# EAGLE design lp_extended (EAGLE 6.5.0)
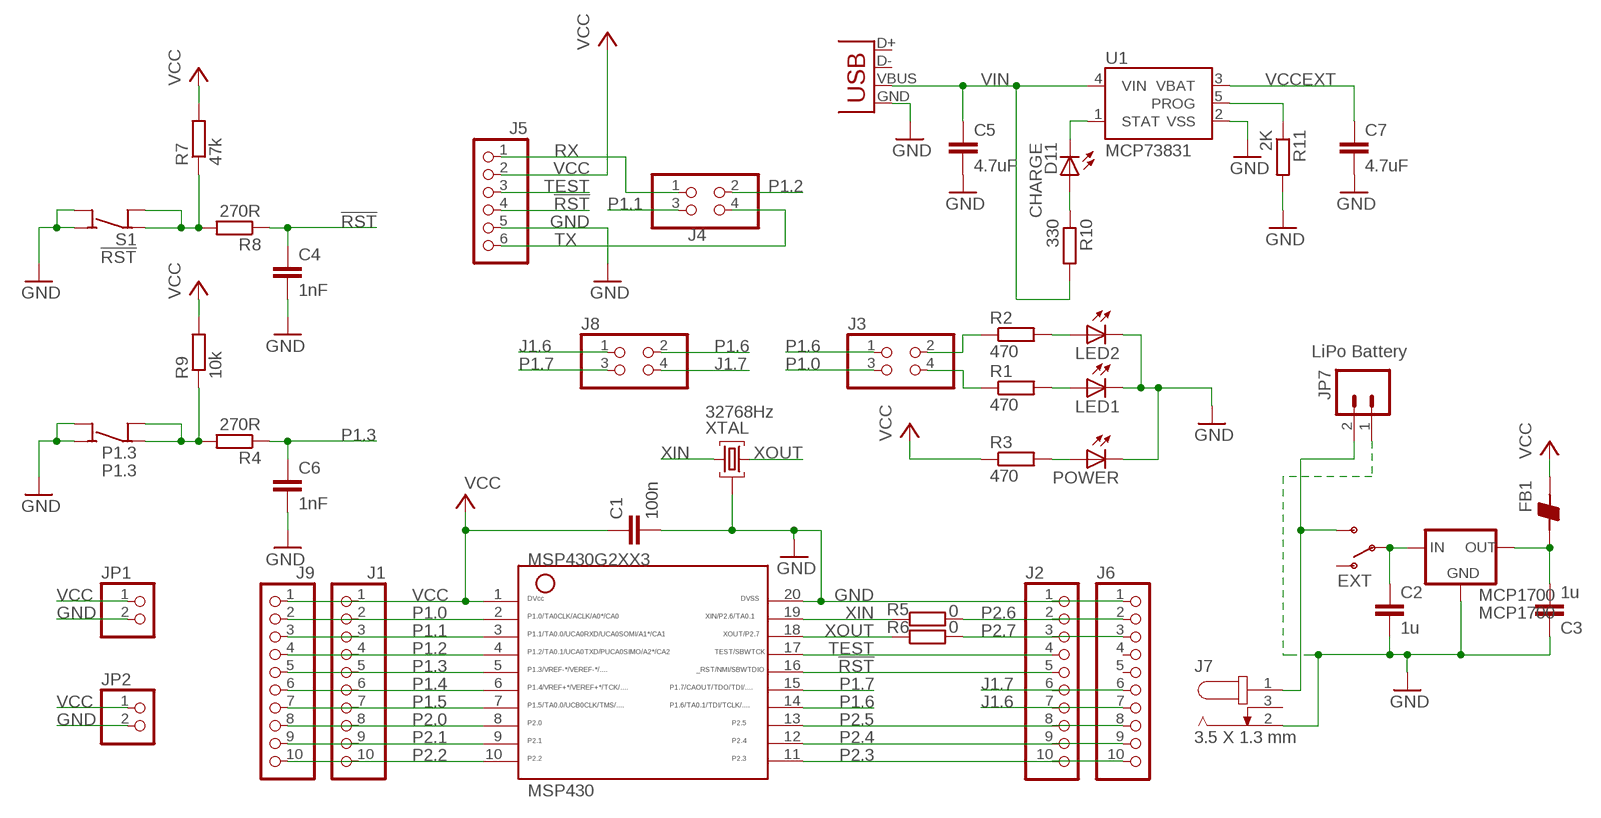
[diagram p0: schematic, sheet 1]

## Parts
C1  100n  C-EUC0805  [C0805]
C2  1u  C-EUC0805  [C0805]
C3  1u  C-EUC0805  [C0805]
C4  1nF  C-EUC0805  [C0805]
C5  4.7uF  C-EUC0805  [C0805]
C6  1nF  C-EUC0805  [C0805]
C7  4.7uF  C-EUC0805  [C0805]
D11  CHARGE  LEDCHIPLED_1206  [CHIPLED_1206]
FB1  BEAD-0805  [0805]
J1  PH1X10OCT076  [PH1X10OCT76]
J2  PH1X10OCT076  [PH1X10OCT76]
J3  PINHD-2X2  [2X02]
J4  PINHD-2X2  [2X02]
J5  PINHD-1X6  [1X06]
J6  PH1X10OCT076  [PH1X10OCT76]
J7  3.5 X 1.3 mm  DC_JACK_3.5X1.3MM  [3.5X1.3MM_DC_JACK]
J8  PINHD-2X2  [2X02]
J9  PH1X10OCT076  [PH1X10OCT76]
JP1  PINHD-1X2  [1X02]
JP2  PINHD-1X2  [1X02]
JP7  LiPo Battery  M02JST-PTH-2  [JST-2-PTH]
LED1  LEDCHIPLED_1206  [CHIPLED_1206]
LED2  LEDCHIPLED_1206  [CHIPLED_1206]
MCP1700  MCP1700  MCP1700SOT-23  [SOT-23]
MSP430  MSP430N  G2XX3---N20HEX  [DIP20_HEX]
ON  EXT  SWITCH-SPSTPTH  [SWITCH-SPDT]
P1.3  P1.3  SPST4  [6MMTACTILE_4PIN]
POWER  LEDCHIPLED_1206  [CHIPLED_1206]
R1  470  R-EU_R0805  [R0805]
R2  470  R-EU_R0805  [R0805]
R3  470  R-EU_R0805  [R0805]
R4  270R  R-EU_R0805  [R0805]
R5  0  R-EU_R0805  [R0805]
R6  0  R-EU_R0805  [R0805]
R7  47k  R-EU_R0805  [R0805]
R8  270R  R-EU_R0805  [R0805]
R9  10k  R-EU_R0805  [R0805]
R10  330  R-EU_R0805  [R0805]
R11  2K  R-EU_R0805  [R0805]
S1  !RST  SPST4  [6MMTACTILE_4PIN]
U1  MCP73831  [SOT23-5]
X1  Mini USB  USBOLD  [USB-MINIB-OLD]
XTAL  32768Hz  QUARZ5  [QUARZ5]

## Nets
!RST: C4.1 J2.5 J5.4 MSP430.16 R8.1
GND [GND]: C1.2 C2.2 C3.1 C4.2 C5.2 C6.2 C7.2 J2.1 J5.5 J6.1 J7.2 JP1.2 JP2.2 JP7.1 LED1.C LED2.C MCP1700.1(GND) MSP430.20 P1.3.A1(NO) P1.3.A2(NO) POWER.C R11.2 S1.A1(NO) S1.A2(NO) U1.2(VSS) X1.GND XTAL.GND@0
J1.6: J2.7 J6.7 J8.1
J1.7: J2.6 J6.6 J8.4
N$1: J3.2 R2.1
N$2: J3.4 R1.1
N$3 [VCC]: C2.1 MCP1700.3(IN) ON.2(P)
N$4: P1.3.B1(COM) P1.3.B2(COM) R4.2 R9.1
N$5: R7.1 R8.2 S1.B1(COM) S1.B2(COM)
N$6 [VCC]: C3.2 FB1.1 MCP1700.2(OUT)
N$7: D11.A R10.1
N$11: POWER.A R3.2
N$13: LED1.A R1.2
N$14: LED2.A R2.2
P1.0: J1.2 J3.3 J9.2 MSP430.2
P1.1: J1.3 J4.3 J9.3 MSP430.3
P1.2: J1.4 J4.2 J9.4 MSP430.4
P1.3: C6.1 J1.5 J9.5 MSP430.5 R4.1
P1.4: J1.6 J9.6 MSP430.6
P1.5: J1.7 J9.7 MSP430.7
P1.6: J3.1 J8.2 MSP430.14
P1.7: J8.3 MSP430.15
P2.0: J1.8 J9.8 MSP430.8
P2.1: J1.9 J9.9 MSP430.9
P2.2: J1.10 J9.10 MSP430.10
P2.3: J2.10 J6.10 MSP430.11
P2.4: J2.9 J6.9 MSP430.12
P2.5: J2.8 J6.8 MSP430.13
P2.6: J2.2 J6.2 R5.2
P2.7: J2.3 J6.3 R6.2
PROG: R11.1 U1.5(PROG)
RX: J4.1 J5.1
STAT: D11.C U1.1(STAT)
TEST: J2.4 J5.3 MSP430.17
TX: J4.4 J5.6
VCC [VCC]: C1.1 FB1.2 J1.1 J5.2 J9.1 JP1.1 JP2.1 MSP430.1 R3.1 R7.2 R9.2
VCCEXT [VCC]: C7.1 J7.1 JP7.2 ON.3(S) U1.3(VBAT)
VIN [VCC]: C5.1 R10.2 U1.4(VIN) X1.VBUS
XIN: MSP430.19 R5.1 XTAL.2
XOUT: MSP430.18 R6.1 XTAL.1
Unconnected: J6.4 J6.5 J7.3 ON.1(O) X1.D+ X1.D-

## Library data of the parts
C1-C3 = rcl:C-EU: CAPACITOR, European symbol
C4-C7 = resistor:C-EU: CAPACITOR, European symbol
D11 LED1 LED2 POWER = led:LED: LED OSRAM: - CHIPLED LG R971, LG N971, LY N971, LG Q971, LY Q971, LO R971, LY R971 LH N974, LH R974 LS Q976, LO Q976, LY Q976 LO Q996 - Hyper CHIPLED LW Q18S LB Q993, LB Q99A, LB R99A - SideLED LS A670, LO A670, LY A670, LG A670, LP A670 LB A673, LV A673, LT A673, LW A673 LH A674 LY A675 LS A676, LA A676, LO A676, LY A676, LW A676 LS A679, LY A679, LG A679 - Hyper Micro SIDELED® LS Y876, LA Y876, LO Y876, LY Y876 LT Y87S - SmartLED LW L88C, LW L88S LB L89C, LB L89S, LG L890 LS L89K, LO L89K, LY L89K LS L896, LA L896, LO L896, LY L896 - TOPLED LS T670, LO T670, LY T670, LG T670, LP T670 LSG T670, LSP T670, LSY T670, LOP T670, LYG T670 LG T671, LOG T671, LSG T671 LB T673, LV T673, LT T673, LW T673 LH T674 LS T676, LA T676, LO T676, LY T676, LB T676, LH T676, LSB T676, LW T676 LB T67C, LV T67C, LT T67C, LS T67K, LO T67K, LY T67K, LW E67C LS E67B, LA E67B, LO E67B, LY E67B, LB E67C, LV E67C, LT E67C LW T67C LS T679, LY T679, LG T679 LS T770, LO T770, LY T770, LG T770, LP T770 LB T773, LV T773, LT T773, LW T773 LH T774 LS E675, LA E675, LY E675, LS T675 LS T776, LA T776, LO T776, LY T776, LB T776 LHGB T686 LT T68C, LB T68C - Hyper Mini TOPLED® LB M676 - Mini TOPLED Santana® LG M470 LS M47K, LO M47K, LY M47K Source: http://www.osram.convergy.de LUXEON: - LUMILED® LXK2-PW12-R00, LXK2-PW12-S00, LXK2-PW14-U00, LXK2-PW14-V00 LXK2-PM12-R00, LXK2-PM12-S00, LXK2-PM14-U00 LXK2-PE12-Q00, LXK2-PE12-R00, LXK2-PE12-S00, LXK2-PE14-T00, LXK2-PE14-U00 LXK2-PB12-K00, LXK2-PB12-L00, LXK2-PB12-M00, LXK2-PB14-N00, LXK2-PB14-P00, LXK2-PB14-Q00 LXK2-PR12-L00, LXK2-PR12-M00, LXK2-PR14-Q00, LXK2-PR14-R00 LXK2-PD12-Q00, LXK2-PD12-R00, LXK2-PD12-S00 LXK2-PH12-R00, LXK2-PH12-S00 LXK2-PL12-P00, LXK2-PL12-Q00, LXK2-PL12-R00 Source: www.luxeon.com KINGBRIGHT: KA-3528ASYC Source: www.kingbright.com
FB1 = CH_passive:BEAD
J1 J2 J6 J9 = MY_CONN:PH1X10
J3 J4 J8 = pinhead:PINHD-2X2: PIN HEADER
J5 = pinhead:PINHD-1X6: PIN HEADER
J7 = MY_CONN:DC_JACK_3.5X1.3MM
JP1 JP2 = pinhead:PINHD-1X2: PIN HEADER
JP7 = SparkFun:M02: Header 2 Standard 2-pin 0.1" header. Use with straight break away headers (SKU : PRT-00116), right angle break away headers (PRT-00553), swiss pins (PRT-00743), machine pins (PRT-00117), and female headers (PRT-00115). Molex polarized connector foot print use with SKU : PRT-08233 with associated crimp pins and housings.
MCP1700 = MY_IC:MCP1700
MSP430 = TI_MSP430_v16:G2XX3---N20: MSP430G2XX1 PDIP (N) 20 Pin Package
ON = SparkFun:SWITCH-SPST: SPST Switch Simple slide switch. Spark Fun Electronics SKU : COM-00102
P1.3 S1 = mes_electromech:SPST4: SPST switch with 2 pins per contact
R1-R4 R7-R11 = resistor:R-EU_: RESISTOR, European symbol
R5 R6 = rcl:R-EU_: RESISTOR, European symbol
U1 = SparkFun:MCP73831: Microchip's MCP73831 Miniature single cell, fully integrated Li-Ion, Li-polymer charge management controller http://ww1.microchip.com/downloads/en/DeviceDoc/21984a.pdf
X1 = SparkFun:USB: USB Connectors USB-B-PTH is fully proven SKU : PRT-00139 USB-miniB is fully proven SKU : PRT-00587 USB-A-PCB is untested. USB-A-H is throughly reviewed, but untested. Spark Fun Electronics SKU : PRT-00437 USB-B-SMT is throughly reviewed, but untested. Needs silkscreen touching up. USB-A-S has not been used/tested USB-MB-H has not been used/tested
XTAL = my_xtal:QUARZ5

## Net classes
0 default: width 0.406 mm, drill 0.508 mm
1 GND: width 0.508 mm, drill 0.508 mm
2 VCC: width 1.016 mm, drill 0.508 mm
4 VCCEXT: width 0.762 mm, drill 0.508 mm, clearance 0.229 mm

## Board
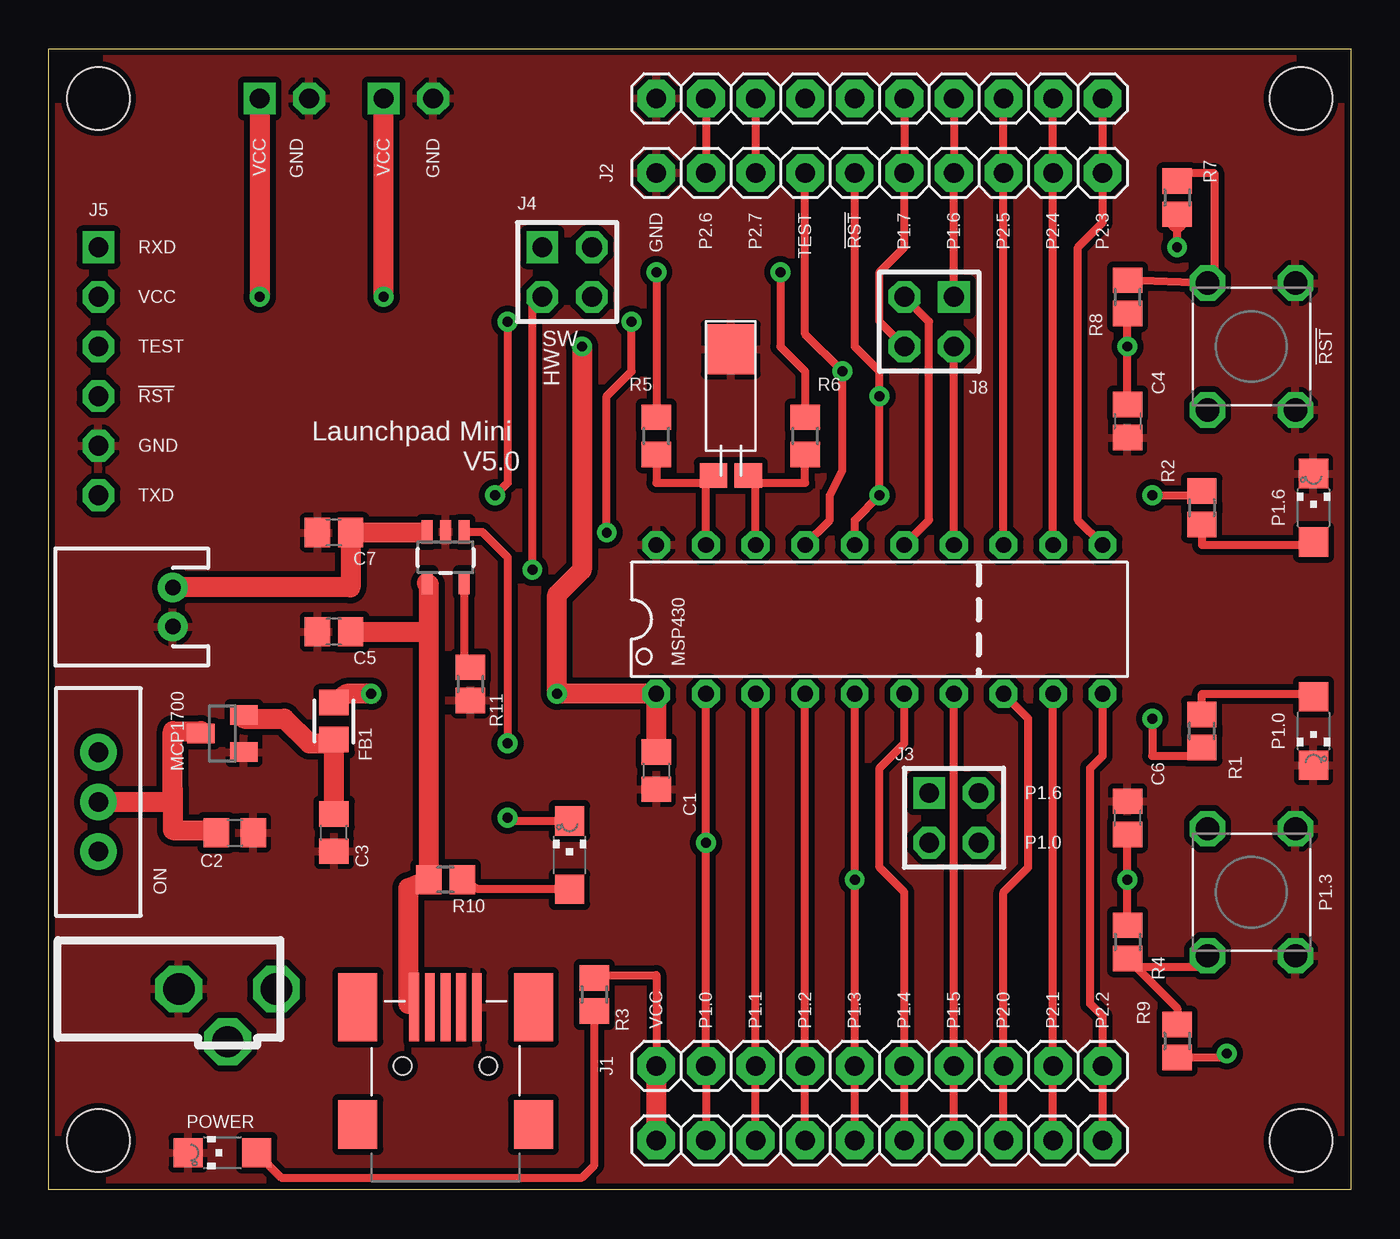
[diagram p1: board, top side]
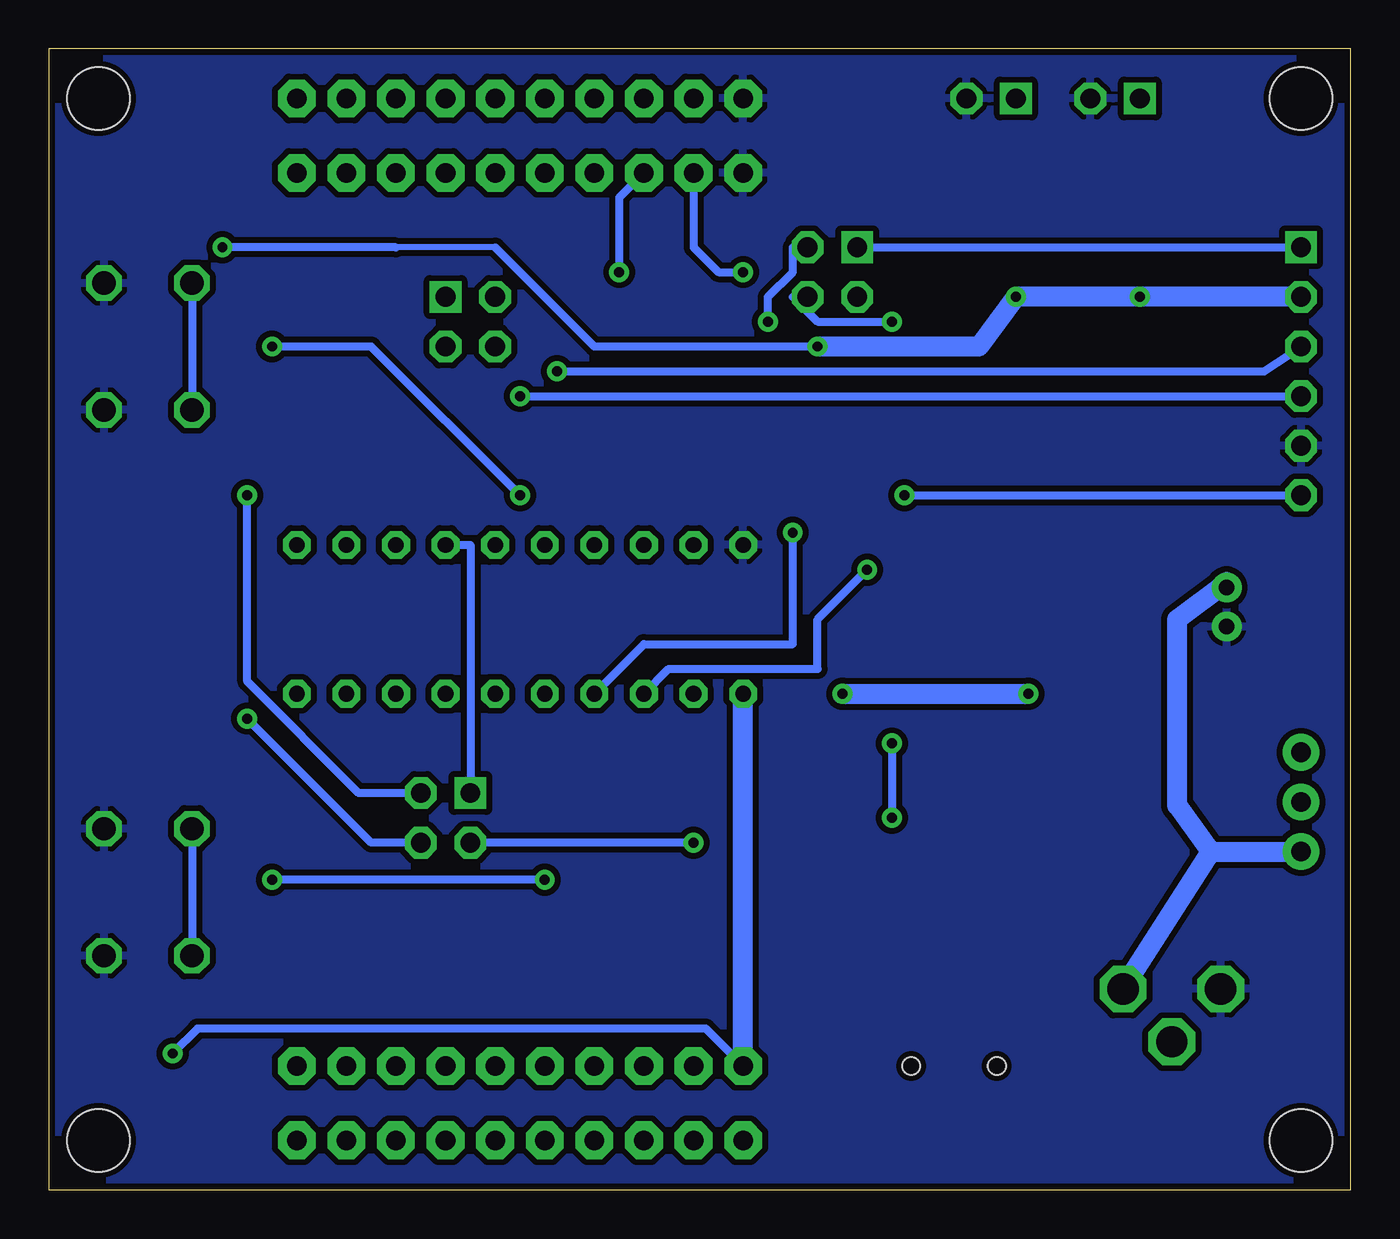
[diagram p2: board, bottom side, seen from below]

Size 66.67 x 58.42 mm. Coordinates in mm from the lower left corner, seen from the top.
Outline: 0,58.42 66.67,58.42 66.67,0 0,0 0,58.42
Copper layers (1*16): Top 0.035mm / dielectric 1.5mm / Bottom 0.035mm
Design rules "SparkFun": minimum track width 8mil, minimum drill 20mil, track to track 8mil, track to pad 8mil, pad to pad 8mil, via to via 8mil, smd to smd 8mil, copper to edge 10mil, drill to drill 8mil, minimum pad ring 12mil, minimum via ring 10mil, stop-mask expansion 4mil, vias tented up to drill 25mil, thermal gap 10mil
Holes 3.2 mm at 2.54,55.88 64.14,55.88 64.14,2.54 2.54,2.54

### Footprints (pad centres in the part's own frame; a part is rotated, then mirrored left to right if it is on the bottom)
C0805 = smd 1.3 x 1.5: 1 -0.95,0; 2 0.95,0
C0805' = smd 1.3 x 1.5: 1 -0.85,0; 2 0.85,0
CHIPLED_1206 = smd 1.5 x 1.5: A 0,-1.75; C 0,1.75
0805 = smd 1.3 x 1.5: 1 -0.95,0; 2 0.95,0
PH1X10OCT76 = drill 1 pad 1.93 octagon: 1 0,0; 2 2.54,0; 3 5.08,0; 4 7.62,0; 5 10.16,0; 6 12.7,0; 7 15.24,0; 8 17.78,0; 9 20.32,0; 10 22.86,0
2X02 = drill 1.016 square: 1 -1.27,-1.27 | drill 1.016 octagon: 2 -1.27,1.27; 3 1.27,-1.27; 4 1.27,1.27
1X06 = drill 1.016 square: 1 -6.35,0 | drill 1.016 octagon: 2 -3.81,0; 3 -1.27,0; 4 1.27,0; 5 3.81,0; 6 6.35,0
3.5X1.3MM_DC_JACK = drill 1.6 octagon: 1 0,0; 2 -5,0; 3 -2.5,-2.7
1X02 = drill 1.016 square: 1 -1.27,0 | drill 1.016 octagon: 2 1.27,0
JST-2-PTH = drill 0.787 pad 1.524: 1 -1,0; 2 1,0
SOT-23 = smd 1 x 1.4: 1 -0.95,-1.1; 2 0.95,-1.1; 3 0,1.1
DIP20_HEX = drill 0.8 pad 1.422 octagon: 1 -10.16,-3.81; 2 -7.62,-3.81; 3 -5.08,-3.81; 4 -2.54,-3.81; 5 0,-3.81; 6 2.54,-3.81; 7 5.08,-3.81; 8 7.62,-3.81; 9 10.16,-3.81; 10 12.7,-3.81; 11 12.7,3.81; 12 10.16,3.81; 13 7.62,3.81; 14 5.08,3.81; 15 2.54,3.81; 16 0,3.81; 17 -2.54,3.81; 18 -5.08,3.81; 19 -7.62,3.81; 20 -10.16,3.81
SWITCH-SPDT = drill 1.016 pad 1.88: 1 0,2.54; 2 0,0; 3 0,-2.54
6MMTACTILE_4PIN = drill 1.2 octagon: A1 3.25,-2.25; A2 -3.25,-2.25; B1 3.25,2.25; B2 -3.25,2.25
R0805 = smd 1.3 x 1.5: 1 -0.85,0; 2 0.85,0
R0805' = smd 1.3 x 1.5: 1 -0.95,0; 2 0.95,0
SOT23-5 = smd 0.55 x 1.2: 1 -0.95,-1.3; 2 0,-1.3; 3 0.95,-1.3; 4 0.95,1.3; 5 -0.95,1.3
USB-MINIB-OLD = smd 2.5 x 2: 1 -3,-4.5; 2 -3,4.5 | smd 3.5 x 2: 3 3,-4.5; 4 3,4.5 | smd 3.5 x 0.5: D+ 3,0; D- 3,0.8; GND 3,-1.6; ID 3,-0.8; VBUS 3.01,1.61 | hole 0.9: 0,2.2; 0,-2.2
QUARZ5 = smd 1.27 x 1.397: 1 0,0.889; 2 0,-0.889 | smd 2.54 x 2.54: GND@0 -6.465,0

### Placement (x,y rotation side)
C1  31.11,21.46 270 top
C2  9.53,18.29 0 top
C3  14.6,18.29 90 top
C4  1nF  [C0805']  55.25,39.37 270 top
C5  4.7uF  [C0805']  14.6,28.57 180 top
C6  1nF  [C0805']  55.25,19.05 90 top
C7  4.7uF  [C0805']  14.6,33.66 180 top
D11  26.67,17.14 0 top
FB1  14.6,24 90 top
J1  31.11,6.35 0 top
J2  31.11,52.07 0 top
J3  46.35,19.05 270 top
J4  26.54,46.99 270 top
J5  2.54,41.91 270 top
J6  31.11,55.88 0 top
J7  11.66,10.29 0 top
J8  45.09,44.45 180 top
J9  31.11,2.54 0 top
JP1  12.06,55.88 0 top
JP2  18.41,55.88 0 top
JP7  6.35,29.85 90 top
LED1  64.77,23.5 180 top
LED2  64.77,34.92 0 top
MCP1700  8.89,23.37 90 top
MSP430  41.27,29.21 0 top
ON  2.54,19.86 0 top
P1.3  61.59,15.24 90 top
POWER  8.89,1.91 90 top
R1  59.05,23.5 90 top
R2  59.05,34.92 270 top
R3  27.94,10.01 270 top
R4  55.25,12.7 270 top
R5  0  [R0805']  31.11,38.61 90 top
R6  0  [R0805']  38.73,38.61 90 top
R7  57.78,50.8 270 top
R8  55.25,45.72 90 top
R9  57.78,7.62 270 top
R10  20.32,15.88 180 top
R11  21.59,25.91 270 top
S1  61.59,43.18 90 top
U1  20.32,32.39 180 top
X1  20.32,6.35 90 top
XTAL  34.92,36.58 270 top

### Tracks (layer width: path | path; a pad name or v marks a point on that pad's centre or on a via)
!RST  (via drill 0.51)
  Top 0.406: C4.1 v55.25,43.18 R8.1 | J2.5 41.27,43.18 42.55,41.91 v42.55,40.64 v42.55,35.56 41.27,34.29 MSP430.16
  Bottom 0.406: v55.25,43.18 50.16,43.18 v42.55,35.56 | v42.55,40.64 J5.4
GND
  pour Top (isolate 0.305): -0.89,-0.51 67.69,-0.51 67.69,59.56 -0.89,59.56
  pour Bottom (isolate 0.305): -0.89,-0.51 67.69,-0.51 67.69,59.56 -0.89,59.56
J1.6
  Top 0.406: J8.1 J2.7 J6.7
J1.7
  Top 0.406: J8.4 42.55,44.45 42.55,46.99 43.81,48.26 J2.6 J6.6
N$1  (via drill 0.51)
  Top 0.406: v56.52,35.56 59.05,35.56 R2.1
  Bottom 0.406: v56.52,35.56 56.52,26.04 50.8,20.32 J3.2
N$2  (via drill 0.51)
  Top 0.406: v56.52,24.13 56.52,22.22 59.05,22.22 R1.1
  Bottom 0.406: v56.52,24.13 50.16,17.78 J3.4
N$3
  Top 1.016: ON.2 6.37,19.88 6.35,20.51 | 6.35,20.51 6.35,23.5 7.79,23.5 MCP1700.3 | 6.35,20.51 6.35,18.42 8.58,18.42 C2.1
N$4
  Top 0.406: P1.3.B2 59.05,11.43 55.88,11.43 R4.2 57.78,9.31 R9.1
  Bottom 0.406: P1.3.B1 P1.3.B2
N$5
  Top 0.406: R7.1 57.78,52.07 59.69,52.07 59.69,46.99 S1.B1 R8.2
  Bottom 0.406: S1.B1 S1.B2
N$6
  Top 1.016: C3.2 FB1.1 14.41,22.86 13.33,22.86 12.06,24.13 9.99,24.13 MCP1700.2
N$7
  Top 0.406: D11.A 21.96,15.39 R10.1
N$11
  Top 0.406: R3.2 27.94,1.27 27.3,0.63 11.91,0.63 POWER.A
N$13
  Top 0.406: R1.2 59.05,25.4 64.77,25.4 LED1.A
N$14
  Top 0.406: R2.2 59.05,33.02 64.77,33.02 LED2.A
P1.0  (via drill 0.51)
  Top 0.406: MSP430.2 v33.66,17.78 J1.2 J9.2
  Bottom 0.406: v33.66,17.78 J3.3
P1.1  (via drill 0.51)
  Top 0.406: MSP430.3 J1.3 J9.3 | v24.77,31.75 24.77,45.72 J4.3
  Bottom 0.406: v24.77,31.75 27.3,29.21 27.3,26.67 34.92,26.67 MSP430.3
P1.2  (via drill 0.51)
  Top 0.406: MSP430.4 J1.4 J9.4 | v29.84,44.45 29.84,41.91 28.57,40.64 v28.57,33.66
  Bottom 0.406: v29.84,44.45 29.84,45.72 28.57,46.99 28.57,48.26 J4.2 | v28.57,33.66 28.57,27.94 36.2,27.94 MSP430.4
P1.3  (via drill 0.51)
  Top 0.406: R4.1 v55.25,15.88 C6.1 | MSP430.5 v41.27,15.88 J1.5 J9.5
  Bottom 0.406: v41.27,15.88 v55.25,15.88
P1.4
  Top 0.406: MSP430.6 43.81,22.86 42.55,21.59 42.55,16.51 43.81,15.24 J1.6 J9.6
P1.5
  Top 0.406: MSP430.7 J1.7 J9.7
P1.6
  Top 0.406: MSP430.14 J8.2
  Bottom 0.406: J3.1 45.09,33.02 MSP430.14
P1.7
  Top 0.406: J8.3 45.09,44.45 45.09,34.29 MSP430.15
P2.0
  Top 0.406: MSP430.8 50.16,24.13 50.16,16.51 48.89,15.24 J1.8 J9.8
P2.1
  Top 0.406: MSP430.9 J1.9 J9.9
P2.2
  Top 0.406: MSP430.10 53.97,22.22 53.34,21.59 53.34,9.52 53.97,8.89 J1.10 J9.10
P2.3
  Top 0.406: MSP430.11 52.7,34.29 52.7,48.26 53.97,49.53 J2.10 J6.10
P2.4
  Top 0.406: MSP430.12 J2.9 J6.9
P2.5
  Top 0.406: MSP430.13 J2.8 J6.8
P2.6  (via drill 0.51)
  Top 0.406: v31.11,46.99 R5.2 | J6.2 J2.2
  Bottom 0.406: J2.2 33.66,48.26 32.38,46.99 v31.11,46.99
P2.7  (via drill 0.51)
  Top 0.406: R6.2 38.73,41.91 37.46,43.18 v37.46,46.99 | J6.3 J2.3
  Bottom 0.406: v37.46,46.99 37.46,50.8 J2.3
PROG
  Top 0.406: U1.5 21.27,27.21 R11.1
RX
  Bottom 0.406: J4.1 J5.1
STAT  (via drill 0.51)
  Top 0.406: U1.1 22.2,33.69 23.49,32.39 v23.49,22.86 | v23.49,19.05 23.49,18.89 D11.C
  Bottom 0.406: v23.49,22.86 v23.49,19.05
TEST  (via drill 0.51)
  Top 0.406: J2.4 38.73,43.81 v40.64,41.91 40.64,36.83 40,35.56 40,34.29 MSP430.17
  Bottom 0.406: J5.3 4.45,41.91 v40.64,41.91
TX  (via drill 0.51)
  Top 0.406: v23.49,44.45 23.49,36.19 v22.86,35.56
  Bottom 0.406: v23.49,44.45 27.3,44.45 28.57,45.72 J4.4 | v22.86,35.56 J5.6
VCC  (via drill 0.51)
  Top 0.406: v57.78,48.26 57.78,49.53 | v60.33,6.98 60.11,6.77 R9.2 | R3.1 28.08,11 31.11,11 J1.1
  Top 1.016: 57.78,49.53 R7.2 | v27.3,43.18 27.3,31.75 26.03,30.48 v26.03,25.4 MSP430.1 C1.1 | v16.51,25.4 15.24,25.4 FB1.2 | v17.15,45.72 JP2.1 | JP1.1 v10.79,45.72 | J9.1 J1.1
  Bottom 0.305: 43.81,48.26 48.89,48.26
  Bottom 0.406: 43.81,48.26 38.73,43.18 v27.3,43.18 | 48.89,48.26 v57.78,48.26 | J1.1 33.02,8.25 59.05,8.25 v60.33,6.98
  Bottom 1.016: J5.2 v10.79,45.72 v17.15,45.72 19.05,43.18 v27.3,43.18 | v26.03,25.4 v16.51,25.4 | J1.1 MSP430.1
VCCEXT
  Top 0.406: U1.3 19.05,33.66
  Top 1.016: 19.05,33.66 C7.1 15.46,30.85 JP7.2
  Bottom 1.016: JP7.2 6.35,31.11 8.89,29.21 8.89,19.68 7.16,17.32 | J7.1 7.16,17.32 | 7.16,17.32 ON.3
VIN
  Top 0.406: X1.VBUS 18.71,13.68 18.41,9.52
  Top 1.016: C5.1 19.47,28.57 | 19.47,28.57 R10.2 18.41,15.45 18.41,9.52 | 19.47,28.57 19.47,30.99 U1.4
XIN
  Top 0.406: MSP430.19 33.66,36.19 | 33.66,36.19 33.66,36.83 XTAL.2 | R5.1 31.11,36.19 33.66,36.19
XOUT
  Top 0.406: MSP430.18 36.2,36.19 | 36.2,36.19 38.73,36.19 R6.1 | 36.2,36.19 XTAL.1

### Text on the board
tPlace: SW | HW | Launchpad Mini / V5.0 | P1.6 | P1.0 | P1.6 | P1.0
tNames: VCC | GND | VCC | GND | GND | P2.6 | P2.7 | TEST | !RST | P1.7 | P1.6 | P2.5 | P2.4 | P2.3 | RXD | VCC | TEST | !RST | GND | TXD | ON | VCC | P1.0 | P1.1 | P1.2 | P1.3 | P1.4 | P1.5 | P2.0 | P2.1 | P2.2